# Altium schematic sheet Mainboard_Wifi_Interface.SchDoc
size A4
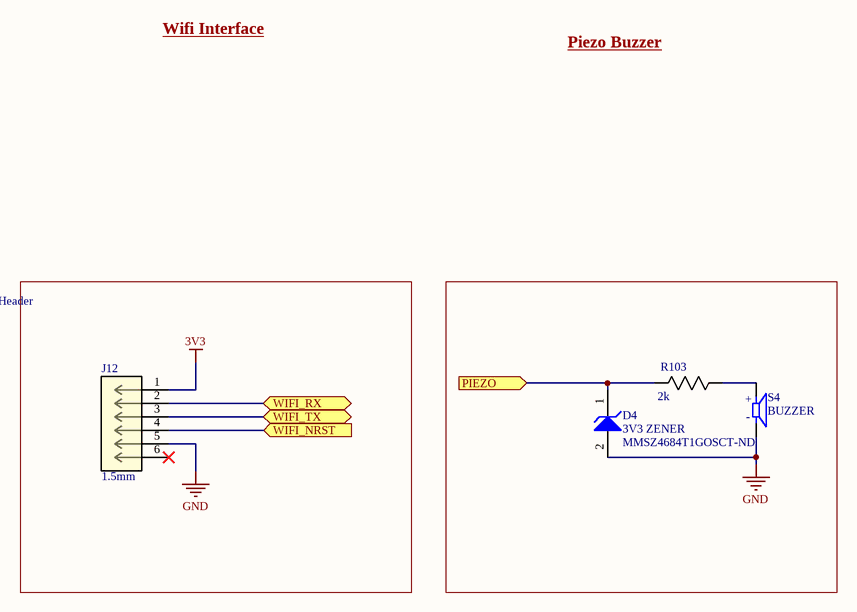
[diagram p0: Mainboard_Wifi_Interface.SchDoc]

## Parts
D4  3V3 ZENER  Supplier Part Number 1: MMSZ4684T1GOSCT-ND  [ONSC-SOD-123-2-425-04_V]
J12  1.5mm  [6POS JST]
R103  2k  [0805]
S4  BUZZER  [PKM13EPYH4000-A0]

## Blocks framed on the sheet
Wifi Interface Header: J12

## Ports
PIEZO (in), WIFI_NRST (in), WIFI_RX (bidir), WIFI_TX (bidir)

## Nets
3V3: J12.1
GND: D4.2(A) J12.5 S4.N
PIEZO: D4.1(K) R103.2(R2) ; port PIEZO
WIFI_NRST: J12.4 ; port WIFI_NRST
WIFI_RX: J12.2 ; port WIFI_RX
WIFI_TX: J12.3 ; port WIFI_TX
NetR103_1: R103.1(R1) S4.P

Not connected (* = marked no-connect by the designer): J12 6*

## Notes on the sheet
- Wifi Interface
- Piezo Buzzer
- (in symbol BUZZER PKM13EPYH4000-A0) +; -

## Library data of the parts
D4 = DIODE ZENER 3.3 500mW: Zener 3V3 Voltage Regulator, 500 mW, 2-Pin SOD-123, Pb-Free, Tape and Reel; PartNumber: MMSZ4684T1G; Manufacturer: On Semiconductor; P Max (W): 0.5; VZ Typ (V): 3.3; ComponentLink2URL: http://www.onsemi.com/pub_link/Collateral/MMSZ4678T1-D.PDF; ComponentLink1URL: http://www.onsemi.com/; ComponentLink2Description: Datasheet; ComponentLink3URL: http://www.onsemi.com/pub_link/Collateral/425-04.PDF; DatasheetVersion: Rev. 9; ComponentLink1Description: Manufacturer URL; RoHS: Pb-Free; ComponentLink3Description: Package Specification; PackageReference: SOD-123-2-425-04; PackageVersion: Rev. G, 10/2009; Mounting Technology: Surface Mount; Packing: Tape and Reel; PackageDescription: 2-Pin SOD, Body 1.6 x 2.69 mm; Supplier 1: Digi-Key
J12 = CN 6POS JST RA: Conn Shrouded Header HDR 6 POS 1.5mm Solder RA Thru-Hole Box; Manufacturer: JST; Manufacturer Part Number: S6B-ZR(LF)(SN); Body Plating: Tin; Number of Positions: 6; Current Rating: 1A; Connector Type: Header,Male Pin; Contact Resistance: 30mR; Voltage Rating: 50V; Gender: Male; Insulation Resistance: 500MR; Panel Thickness: 3.5mm; Supplier 1: Digi-Key; RoHS: Yes; Category: Headers and Wire Housings; Stock 1: 14808; Mount: Through Hole; Number of Pins: 6; Color: White; Contact Plating: Tin,Copper; Contact Material: Brass,Tin,Copper; Housing Color: Beige; Housing Material: Polyamide; Material: Nylon; Contact Shape: Circular; Insulation Material: Nylon; Insulation Color: Natural; Min Operating Temperature: -25°C; Max Operating Temperature: 85°C; Number of Rows: 1; Packaging: Bulk; Termination: Solder; Fastening Type: Detent; Number of Contacts: 6; Max Voltage Rating (AC): 50V; Max Current Rating: 1A; Orientation: Right Angle; Voltage Rating (AC): 50V; Voltage Rating (DC): 50V; Length: 10.5mm; Width: 3.5mm; Height: 7.2mm; Pitch: 1.5mm; Depth: 6mm; Lead Pitch: 1.5mm; Contact Mating Length: 0.094inch; Lead Free: Lead Free; Flammability Rating: UL94 V-0; REACH SVHC: No SVHC; ComponentLink1URL: https://datasheet.ciiva.com/8052/80556-8052225.pdf?src-supplier=Element14; ComponentLink1Description: https://datasheet.ciiva.com/8052/80556-8052225.pdf?src-supplier=Element14; ComponentLink2URL: https://datasheet.ciiva.com/25617/0900766b81147f94-25617345.pdf?src-supplier=RSComponents; ComponentLink2Description: https://datasheet.ciiva.com/25617/0900766b81147f94-25617345.pdf?src-supplier=RSComponents; ComponentLink3URL: https://datasheet.ciiva.com/11752/0900766b8082f593-11752194.pdf?src-supplier=RSComponents; ComponentLink3Description: https://datasheet.ciiva.com/11752/0900766b8082f593-11752194.pdf?src-supplier=RSComponents; ComponentLink4URL: https://datasheet.ciiva.com/26894/getdatasheetpartid-642095-26894637.pdf?src-supplier=Verical; ComponentLink4Description: https://datasheet.ciiva.com/26894/getdatasheetpartid-642095-26894637.pdf?src-supplier=Verical; ComponentLink5URL: https://datasheet.ciiva.com/712/ezh-712560.pdf?src-supplier=Digi-Key; ComponentLink5Description: https://datasheet.ciiva.com/712/ezh-712560.pdf?src-supplier=Digi-Key; ComponentLink6URL: https://datasheet.ciiva.com/16484/s6b-zrlfsn-16484554.pdf?src-supplier=Future+Electronics; ComponentLink6Description: https://datasheet.ciiva.com/16484/s6b-zrlfsn-16484554.pdf?src-supplier=Future+Electronics; Supplier Part Number 1: 455-1673-ND
R103 = RES 2k 1/8W: RES SMD 2K OHM 5% 1/8W 0805; Power (Watts): 0.125W; Package: 0805; Value: 2k; Tolerance: 5%
S4 = BUZZER PKM13EPYH4000-A0: Max Voltage: 30V; Decibels: 70dB @ 1.5V, 10cm; Rated Voltage: 1.5V; Supplier: Digikey; Supplier Part Number: 490-4698-1-ND; Part Name: BUZZER PKM13EPYH4000-A0